# Altium schematic sheet 原理图.SchDoc
size A3
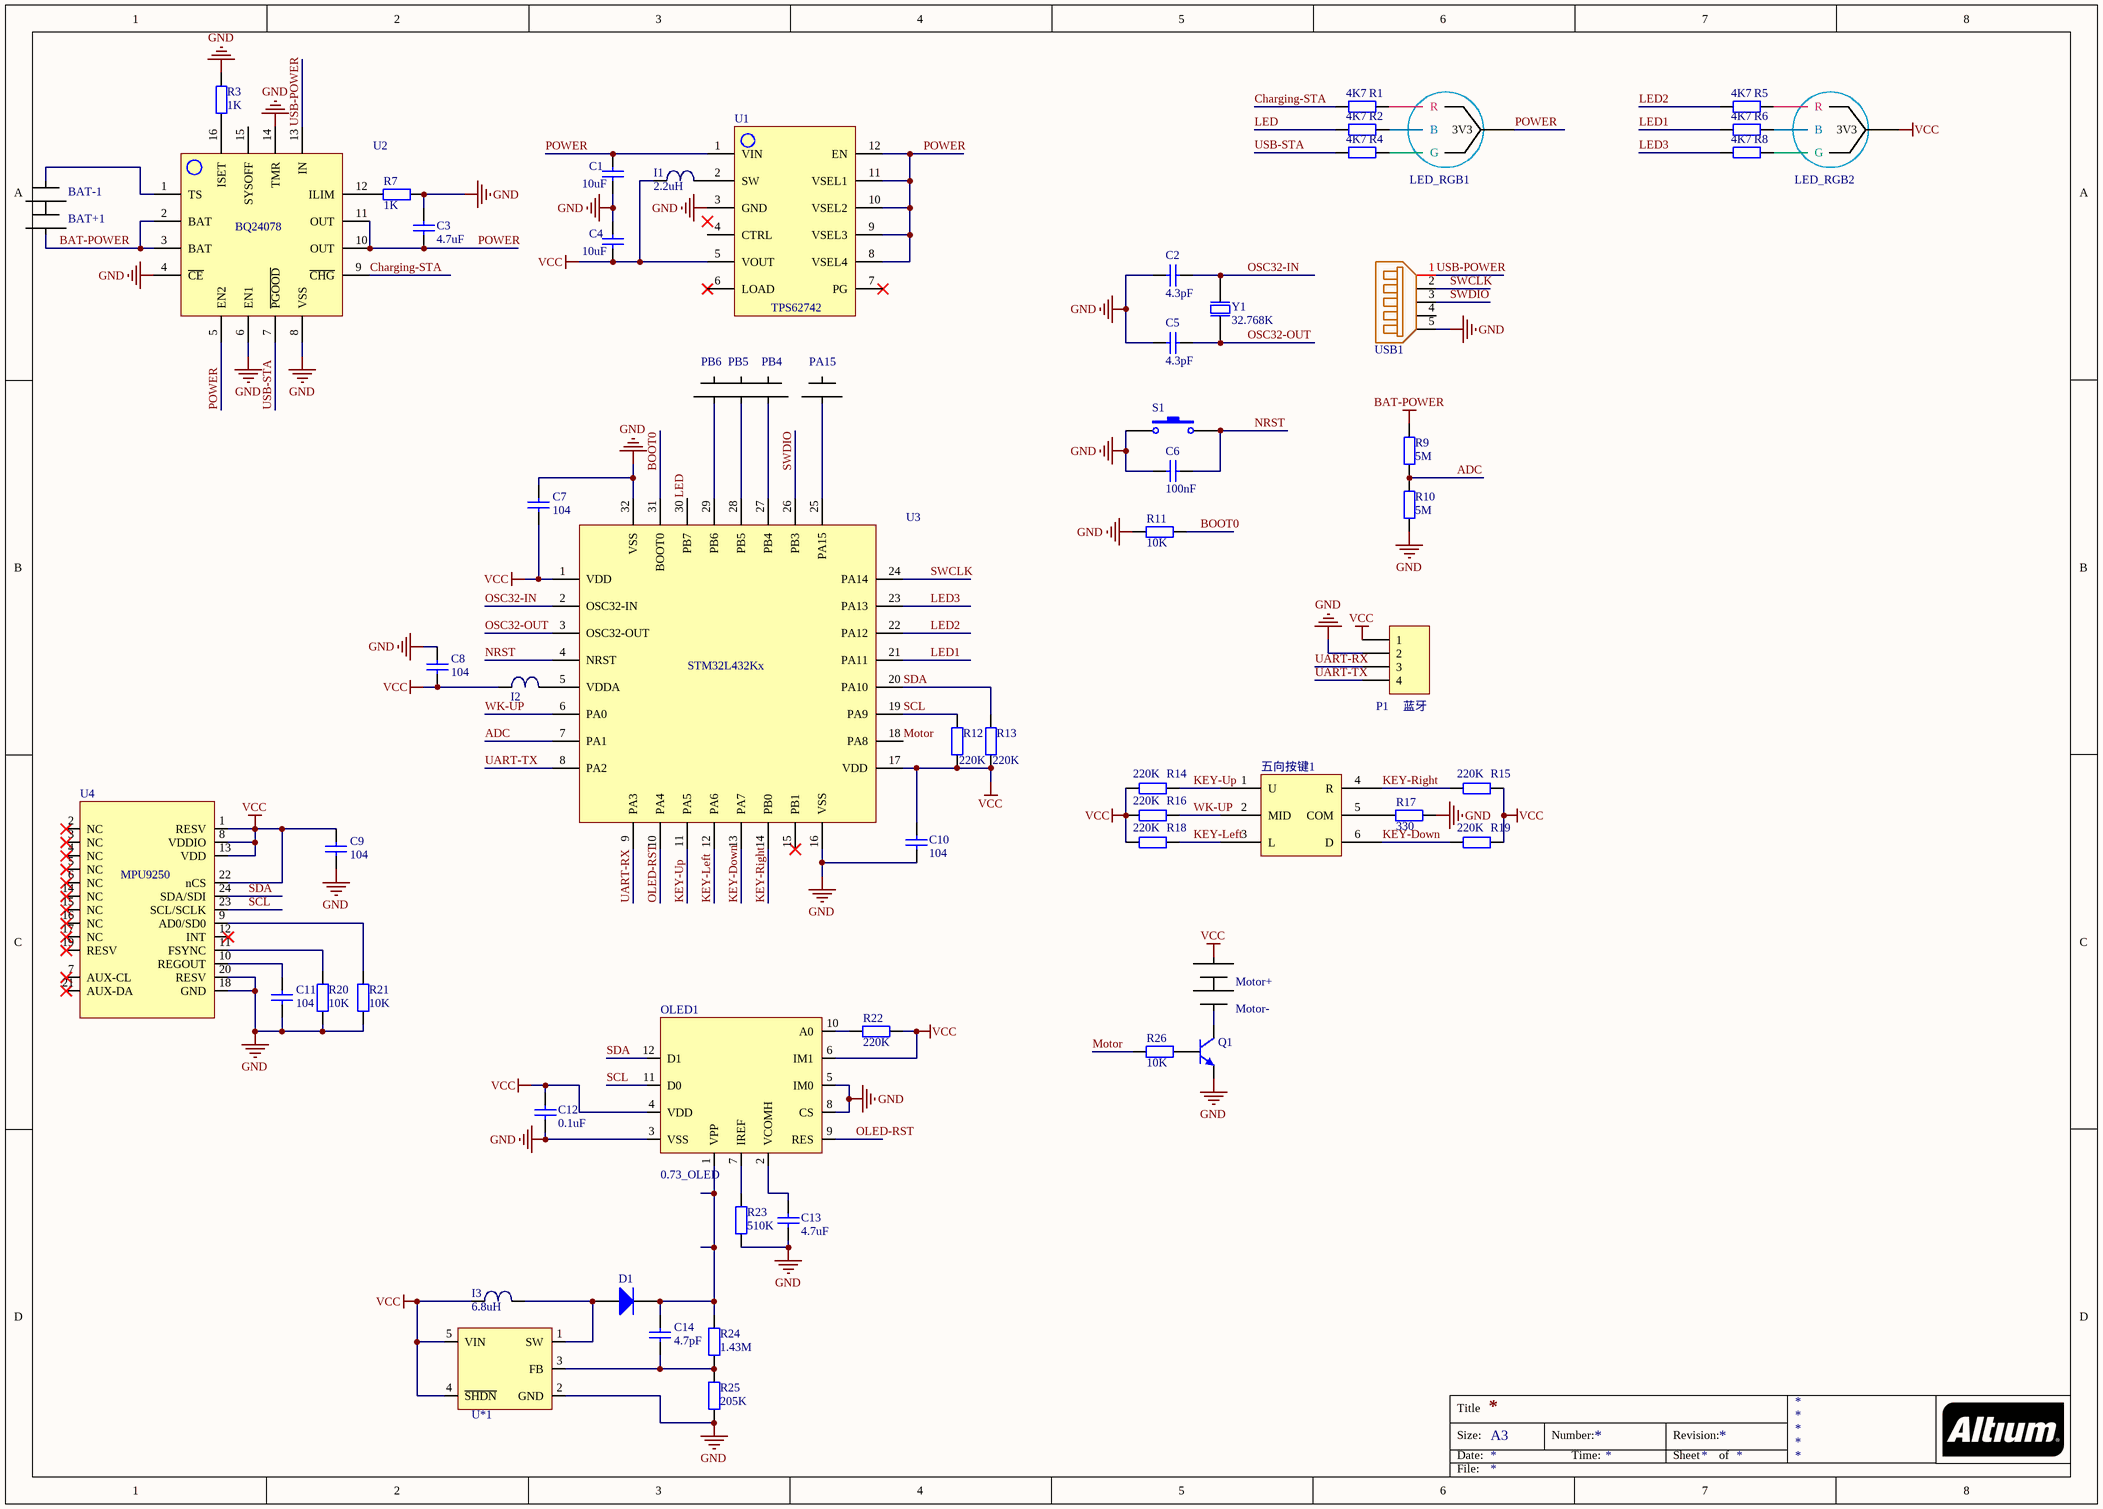
[diagram p0: 原理图.SchDoc]

## Parts
BAT+1  BAT  [BAT+]  (value not drawn)
BAT-1  BAT  [BTA-]  (value not drawn)
C1  10uF  [1__0603-CAP_]
C2  4.3pF  [1__0603-CAP_]
C3  4.7uF  [1__0603-CAP_]
C4  10uF  [1__0603-CAP_]
C5  4.3pF  [1__0603-CAP_]
C6  100nF  [1__0603-CAP_]
C7  104  [1__0603-CAP_]
C8  104  [1__0603-CAP_]
C9  104  [1__0603-CAP_]
C10  104  [1__0603-CAP_]
C11  104  [1__0603-CAP_]
C12  0.1uF  [1__0603-CAP_]
C13  4.7uF  [1__0603-CAP_]
C14  4.7pF  [1__0603-CAP_]
D1  Diode  [二极管1206]  (value not drawn)
I1  2.2uH  [1__0805_IND]
I2  100uH  [1__0603_Ind_]  (value not drawn)
I3  6.8uH  [0805_Ind]
LED_RGB1  L*  [1__LED_RGB]  (value not drawn)
LED_RGB2  L*  [1__LED_RGB]  (value not drawn)
Motor+  BAT  [BAT+]  (value not drawn)
Motor-  BAT  [BTA-]  (value not drawn)
OLED1  0.73_OLED  [0.73OLED]
P1  蓝牙  [BT]
PA15  BAT  [BAT+]  (value not drawn)
PB4  BAT  [BAT+]  (value not drawn)
PB5  BAT  [BAT+]  (value not drawn)
PB6  BAT  [BAT+]  (value not drawn)
Q1  NPN-J3Y/Y1  [SOT23]  (value not drawn)
R1  4K7  [1__0603-RES_]
R2  4K7  [1__0603-RES_]
R3  1K  [1__0603-RES_]
R4  4K7  [1__0603-RES_]
R5  4K7  [1__0603-RES_]
R6  4K7  [1__0603-RES_]
R7  1K  [1__0603-RES_]
R8  4K7  [1__0603-RES_]
R9  5M  [1__0603-RES_]
R10  5M  [1__0603-RES_]
R11  10K  [1__0603-RES_]
R12  220K  [1__0603-RES_]
R13  220K  [1__0603-RES_]
R14  220K  [1__0603-RES_]
R15  220K  [1__0603-RES_]
R16  220K  [1__0603-RES_]
R17  330  [1__0603-RES_]
R18  220K  [1__0603-RES_]
R19  220K  [1__0603-RES_]
R20  10K  [1__0603-RES_]
R21  10K  [1__0603-RES_]
R22  220K  [1__0603-RES_]
R23  510K  [1__0603-RES_]
R24  1.43M  [1__0603-RES_]
R25  205K  [1__0603-RES_]
R26  10K  [1__0603-RES_]
S1  (no value)  [key3*4*2]
U1  TPS62742  [TPS62742]
U2  BQ24078  [BQ24078]
U3  STM32L432Kx  [STM32L432]
U4  MPU9250  [1__QFN3*3 (改1)]
U*1  OLED升压  [1__SOT23-5]  (value not drawn)
USB1  USB-5P  [1__Micro USB 立贴_]  (value not drawn)
Y1  32.768K  [OSC32]
五向按键1  五向按键  [1__五向按键_]  (value not drawn)

## Nets
BAT-POWER: BAT+1.1 R9.1 U2.2(BAT) U2.3(BAT)
GND: C1.1 C2.2 C3.2 C4.2 C5.2 C6.1 C7.2 C8.2 C9.1 C10.2 C11.1 C12.2 C13.2 OLED1.3(VSS) OLED1.5(IM0) OLED1.8(CS) P1.2 Q1.2(E) R3.1 R7.1 R10.2 R11.2 R17.1 R20.1 R21.1 R23.2 R25.2 S1.1 U1.3(GND) U2.4(~{CE}) U2.6(EN1) U2.8(VSS) U2.14(TMR) U3.16(VSS) U3.32(VSS) U4.18(GND) U4.20(RESV) U*1.2(GND) USB1.5(GND)
VCC: C4.1 C7.1 C8.1 C9.2 C10.1 C12.1 I1.1 I2.1 I3.1 LED_RGB2.2(3V3) Motor+.1 OLED1.4(VDD) OLED1.6(IM1) P1.1 R12.1 R13.1 R14.1 R15.2 R16.1 R18.1 R19.2 R22.2 U1.5(VOUT) U3.1(VDD) U3.17(VDD) U4.1(RESV) U4.8(VDDIO) U4.13(VDD) U4.22(nCS) U*1.4(~{SHDN}) U*1.5(VIN)
ADC: R9.2 R10.1 U3.7(PA1)
BOOT0: R11.1 U3.31(BOOT0)
Charging-STA: R1.2 U2.9(~{CHG})
KEY-Down: R19.1 U3.13(PA7) 五向按键1.6(D)
KEY-Left: R18.2 U3.12(PA6) 五向按键1.3(L)
KEY-Right: R15.1 U3.14(PB0) 五向按键1.4(R)
KEY-Up: R14.2 U3.11(PA5) 五向按键1.1(U)
LED: R2.2 U3.30(PB7)
LED1: R6.2 U3.21(PA11)
LED2: R5.2 U3.22(PA12)
LED3: R8.2 U3.23(PA13)
Motor: R26.2 U3.18(PA8)
NRST: C6.2 S1.2 U3.4(NRST)
OLED-RST: OLED1.9(RES) U3.10(PA4)
OSC32-IN: C2.1 U3.2(OSC32-IN) Y1.2(OSC2)
OSC32-OUT: C5.1 U3.3(OSC32-OUT) Y1.1(OSC1)
POWER: C1.2 C3.1 LED_RGB1.2(3V3) U1.1(VIN) U1.8(VSEL4) U1.9(VSEL3) U1.10(VSEL2) U1.11(VSEL1) U1.12(EN) U2.5(EN2) U2.10(OUT) U2.11(OUT)
SCL: OLED1.11(D0) R12.2 U3.19(PA9) U4.23(SCL/SCLK)
SDA: OLED1.12(D1) R13.2 U3.20(PA10) U4.24(SDA/SDI)
SWCLK: U3.24(PA14) USB1.2(D-)
SWDIO: U3.26(PB3) USB1.3(D+)
UART-RX: P1.3 U3.9(PA3)
UART-TX: P1.4 U3.8(PA2)
USB-POWER: U2.13(IN) USB1.1(VBUS)
USB-STA: R4.2 U2.7(~{PGOOD})
WK-UP: R16.2 U3.6(PA0) 五向按键1.2(MID)
NetBAT+1_2: BAT+1.2 BAT-1.1
NetBAT-1_2: BAT-1.2 U2.1(TS)
NetC11_2: C11.2 U4.10(REGOUT)
NetC13_1: C13.1 OLED1.2(VCOMH)
NetC14_1: C14.1 R24.2 R25.1 U*1.3(FB)
NetC14_2: C14.2 D1.2(K) OLED1.1(VPP) R24.1
NetD1_1: D1.1(A) I3.2 U*1.1(SW)
NetI1_2: I1.2 U1.2(SW)
NetI2_2: I2.2 U3.5(VDDA)
NetLED_RGB1_1: LED_RGB1.1(R) R1.1
NetLED_RGB1_3: LED_RGB1.3(G) R4.1
NetLED_RGB1_4: LED_RGB1.4(B) R2.1
NetLED_RGB2_1: LED_RGB2.1(R) R5.1
NetLED_RGB2_3: LED_RGB2.3(G) R8.1
NetLED_RGB2_4: LED_RGB2.4(B) R6.1
NetMotor+_2: Motor+.2 Motor-.1
NetMotor-_2: Motor-.2 Q1.3(C)
NetOLED1_7: OLED1.7(IREF) R23.1
NetOLED1_10: OLED1.10(A0) R22.1
NetPA15_1: PA15.1 U3.25(PA15)
NetPB4_1: PB4.1 U3.27(PB4)
NetPB5_1: PB5.1 U3.28(PB5)
NetPB6_1: PB6.1 U3.29(PB6)
NetQ1_1: Q1.1(B) R26.1
NetR3_2: R3.2 U2.16(ISET)
NetR7_2: R7.2 U2.12(ILIM)
NetR17_2: R17.2 五向按键1.5(COM)
NetR20_2: R20.2 U4.11(FSYNC)
NetR21_2: R21.2 U4.9(AD0/SD0)

Not connected (* = marked no-connect by the designer): PA15 2; PB4 2; PB5 2; PB6 2; U1 4(CTRL) 6(LOAD)* 7(PG)*; U2 15(SYSOFF); U3 15(PB1)*; U4 2(NC)* 3(NC)* 4(NC)* 5(NC)* 6(NC)* 7(AUX-CL)* 12(INT)* 14(NC)* 15(NC)* 16(NC)* 17(NC)* 19(RESV)* 21(AUX-DA)*; USB1 4(ID)

## Notes on the sheet
- Title
- Size:
- Date:
- A3
- Number:
- Time:
- Revision:
- Sheet
- of
- File:

## Library data of the parts
C1-C6 = Cap: Capacitor; Value: 105
C7-C11 = Cap: Capacitor; Value: 104
C12-C14 = Cap: Capacitor; Value: 104
D1 = Diode: Default Diode; Published: 8-Jun-2000; LatestRevisionDate: 17-Jul-2002; LatestRevisionNote: Re-released for DXP Platform.; PackageVersion: Sep-1996; PackageReference: SMC; Publisher: Altium Limited; PackageDescription: DO-214-AB/SMC; 2 C-Bend Leads; Body 7.9 x 5.9 mm, inc. leads (LxW); Code_JEDEC: DO-214-AB
I1 I3 = 电感: Value: 100uH
I2 = 电感: Value: 100uH
LED_RGB1 LED_RGB2 = LED_RGB
P1 = Header 4: Header, 4-Pin
Q1 = NPN BC817-40: NPN Bipolar Transistor; Published: 8-Jun-2000; Revision: July-2002: Re-released for DXP Platform.; Publisher: Altium Limited; Price(RMB): 0.000; PartNumber: BC817-40
R1 R2 R4-R6 R8 R20 R21 R26 = Res2: Resistor
  R1 R2 R4-R6 R8: Value: 4K7
  R20 R21 R26: Value: 10K
R3 R7 R9-R11 R14-R19 = Res2: Resistor; Value: 4K7
R12 R13 R22-R25 = Res2: Resistor; Value: 10K
S1 = SW-PB: Switch
U1 = TPS62742: 锂电池稳压
U2 = BQ24078: 充电芯片
U3 = STM32L432Kx: 单片机
U*1 = TPS61040
USB1 = USB-5P: USB CONNECTOR
Y1 = XTAL: Crystal Oscillator; Value: 16M